# Altium project test.PrjPcb
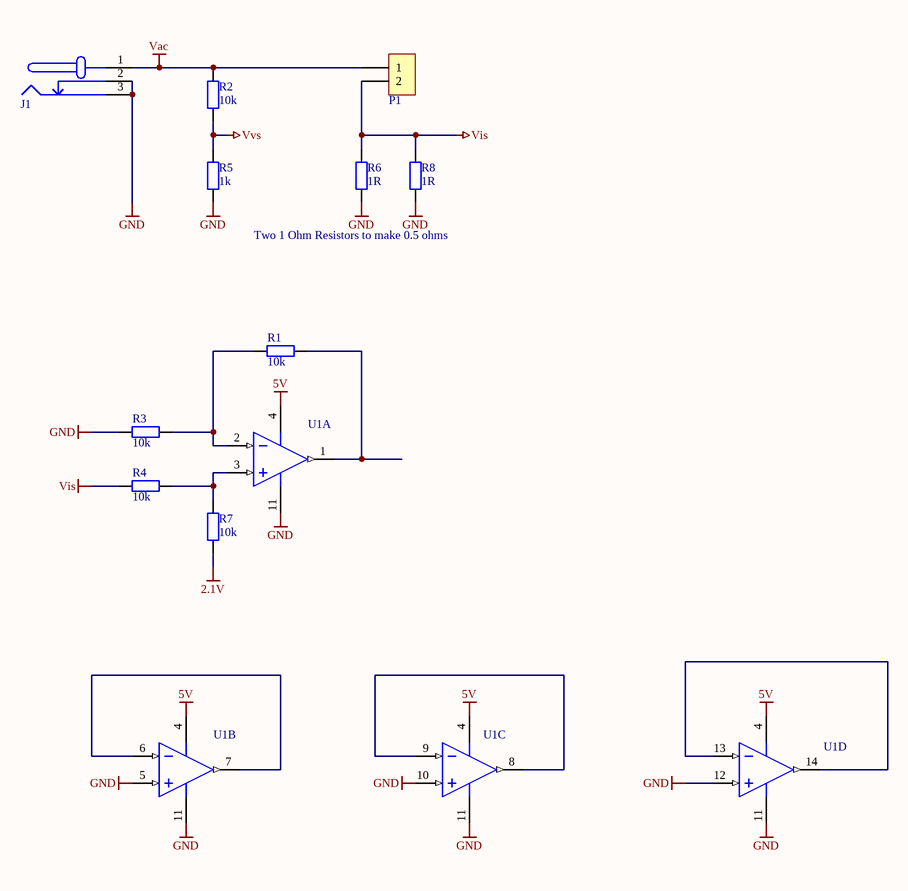
[diagram p0: Sheet1.SchDoc]
1 sheet, 11 parts. Net scope: global (net labels, ports and power ports of the same name join across sheets).
Board file: PCB1.PcbDoc

## Sheet Sheet1.SchDoc
size A4; SheetNumber: 1; SheetTotal: 1

### Parts
J1  DC barrel jack  [AC-Socket]  (value not drawn)
P1  Dual Banana Plugs  [Dual Banana Plug]  (value not drawn)
R1  10k  [AXIAL-0.4]
R2  10k  [AXIAL-0.4]
R3  10k  [AXIAL-0.4]
R4  10k  [AXIAL-0.4]
R5  1k  [AXIAL-0.4]
R6  1R  [AXIAL-0.4]
R7  10k  [AXIAL-0.4]
R8  1R  [AXIAL-0.4]
U1  LM324  [DIP-14]  (value not drawn)  (parts A,B,C,D of 4)

### Nets
2.1V: R7.1
5V: U1.4(VDD)
GND: J1.2(GND_ALT) J1.3(GND) R3.1 R5.1 R6.1 R8.1 U1.5(VINB+) U1.10(VINC+) U1.11(VSS) U1.12(VIND+)
Vac: J1.1(VCC) P1.1 R2.2
Vis: P1.2 R4.1 R6.2 R8.2
Vvs: R2.1 R5.2
NetR1_1: R1.1 R3.2 U1.2(VINA-)
NetR1_2: R1.2 U1.1(VOUTA)
NetR4_2: R4.2 R7.2 U1.3(VINA+)
NetU1_6: U1.6(VINB-) U1.7(VOUTB)
NetU1_8: U1.8(VOUTC) U1.9(VINC-)
NetU1_13: U1.13(VIND-) U1.14(VOUTD)

### Notes on the sheet
- Two 1 Ohm Resistors to make 0.5 ohms

### Library data of the parts
J1 = AC_Input: DC barrel jack connection to AC source; Value: socket
P1 = AC_Output: Dual banana plugs connection to the AC load; LatestRevisionDate: 17-Jul-2002; LatestRevisionNote: Re-released for DXP Platform.; Publisher: Altium Limited
R1 R2 = Res_TH_0AX4: Through hole resistor; Value: 100k; Published: 8-Jun-2000; LatestRevisionDate: 17-Jul-2002; LatestRevisionNote: Re-released for DXP Platform.; PackageReference: AXIAL-0.4; Publisher: Altium Limited; ComponentLink1Description: http://www.royalohm.com/pdf/product2017/PrecisionMetalMF.pdf
R3 R4 R7 R8 = Res_TH_0AX4: Through hole resistor; Published: 8-Jun-2000; LatestRevisionDate: 17-Jul-2002; LatestRevisionNote: Re-released for DXP Platform.; PackageReference: AXIAL-0.4; Publisher: Altium Limited; ComponentLink1Description: http://www.royalohm.com/pdf/product2017/PrecisionMetalMF.pdf
  R3 R4: Value: 10k
  R7 R8: Value: *
R5 = Res_TH_0AX4: Through hole resistor; Value: 1k2; Published: 8-Jun-2000; LatestRevisionDate: 17-Jul-2002; LatestRevisionNote: Re-released for DXP Platform.; PackageReference: AXIAL-0.4; Publisher: Altium Limited; ComponentLink1Description: http://www.royalohm.com/pdf/product2017/PrecisionMetalMF.pdf
R6 = Res_TH_0AX4: Through hole resistor; Value: 1; Published: 8-Jun-2000; LatestRevisionDate: 17-Jul-2002; LatestRevisionNote: Re-released for DXP Platform.; PackageReference: AXIAL-0.4; Publisher: Altium Limited; ComponentLink1Description: http://www.royalohm.com/pdf/product2017/PrecisionMetalMF.pdf
U1 = LM324N_TH_DIP16: IC OPAMP GP 14DIP; Manufacturer: ON Semiconductor; Manufacturer Part Number: LM324N; Amplifier Type: General Purpose; Current - Supply: 1mA; Voltage - Supply, Single/Dual (±): 3 V ~ 32 V, ±1.5 V ~ 16 V; Supplier 1: Digi-Key; RoHS: RoHS Compliant; Category: Integrated Circuits (ICs); Stock 1: 2900; Pricing 1: 1=0.9, 10=0.775, 100=0.5789, 500=0.45482, 1000=0.35145 (NZD); Packaging: Tube; Part Status: Active; Output Type: -; Slew Rate: -; Operating Temperature: 0°C ~ 70°C; Mounting Type: Through Hole; Package / Case: 14-DIP (0.300", 7.62mm); Supplier Device Package: 14-DIP; Base Part Number: LM324; ComponentLink1URL: https://www.fairchildsemi.com/datasheets/LM/LM2902.pdf; ComponentLink1Description: https://www.fairchildsemi.com/datasheets/LM/LM2902.pdf; Supplier Part Number 1: LM324NFS-ND